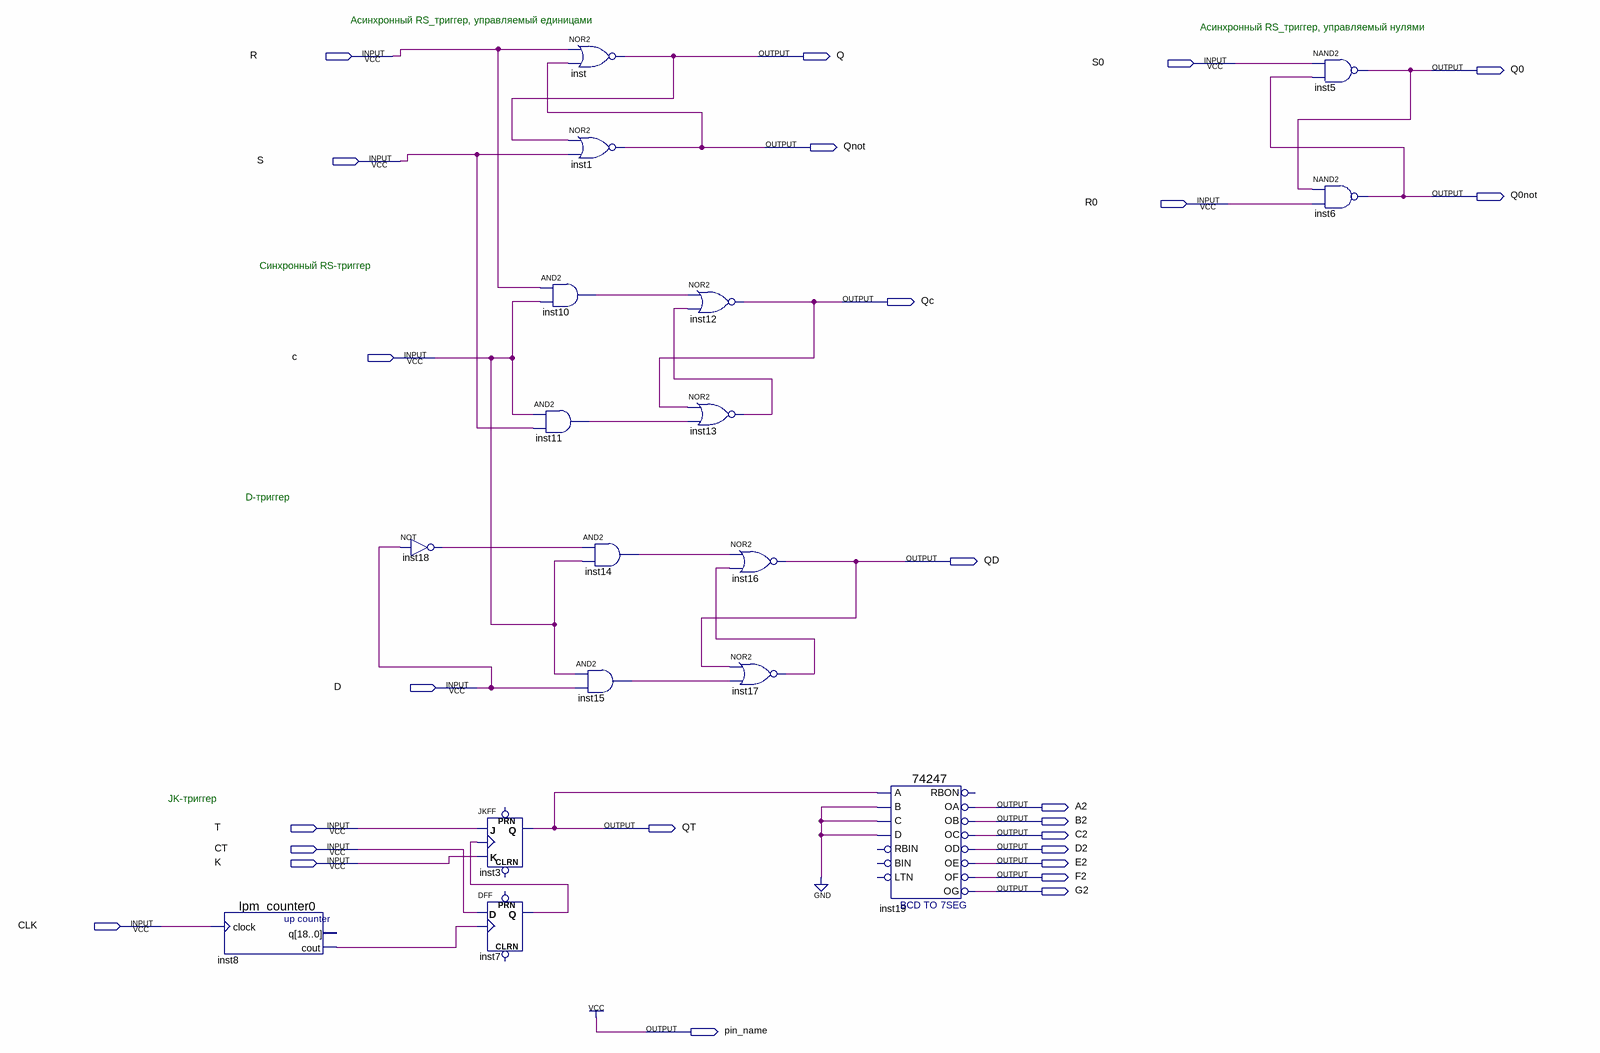
[diagram p0: schematic sheet]
// Quartus schematic triggers.bdf as structural Verilog: 17 symbols, 25 pins
module triggers (
  input  R,
  input  S0,
  input  S,
  input  R0,
  input  c,
  input  D,
  input  T,
  input  CT,
  input  K,
  input  CLK,
  output Q,
  output Q0,
  output Qnot,
  output Q0not,
  output Qc,
  output QD,
  output A2,
  output B2,
  output QT,
  output C2,
  output D2,
  output E2,
  output F2,
  output G2,
  output pin_name
);

  wire inst7_q, inst8_cout, inst10_out, inst11_out, inst13_out, inst14_out, inst15_out, inst17_out,
       inst18_out;

  lpm_counter0 inst8 (.clock(CLK), .cout(inst8_cout));  // open: q
  not inst18 (inst18_out, D);
  JKFF inst3 (.K(K), .J(T), .CLK(inst7_q), .Q(QT));  // open: PRN, CLRN
  DFF inst7 (.CLK(inst8_cout), .D(CT), .Q(inst7_q));  // open: CLRN, PRN
  and inst10 (inst10_out, R, c);
  and inst11 (inst11_out, c, S);
  nor inst (Q, R, Qnot);
  nor inst1 (Qnot, Q, S);
  and inst14 (inst14_out, inst18_out, c);
  and inst15 (inst15_out, c, D);
  nor inst12 (Qc, inst10_out, inst13_out);
  nor inst13 (inst13_out, Qc, inst11_out);
  nor inst16 (QD, inst14_out, inst17_out);
  nor inst17 (inst17_out, QD, inst15_out);
  \74247  inst19 (
    .A(QT), .B(1'b0), .C(1'b0), .D(1'b0), .OF(F2), .OC(C2), .OD(D2), .OE(E2), .OA(A2), .OB(B2), .OG(G2));  // open: LTN, BIN, RBIN, RBON
  nand inst5 (Q0, S0, Q0not);
  nand inst6 (Q0not, Q0, R0);

  assign pin_name = 1'b1;

  // Notes on the sheet:
  //   Асинхронный RS_триггер, управляемый единицами
  //   Асинхронный RS_триггер, управляемый нулями
  //   Синхронный RS-триггер
  //   D-триггер
  //   JK-триггер
endmodule
